# Altium project PS32-lite-rev_a_public.PrjPcb
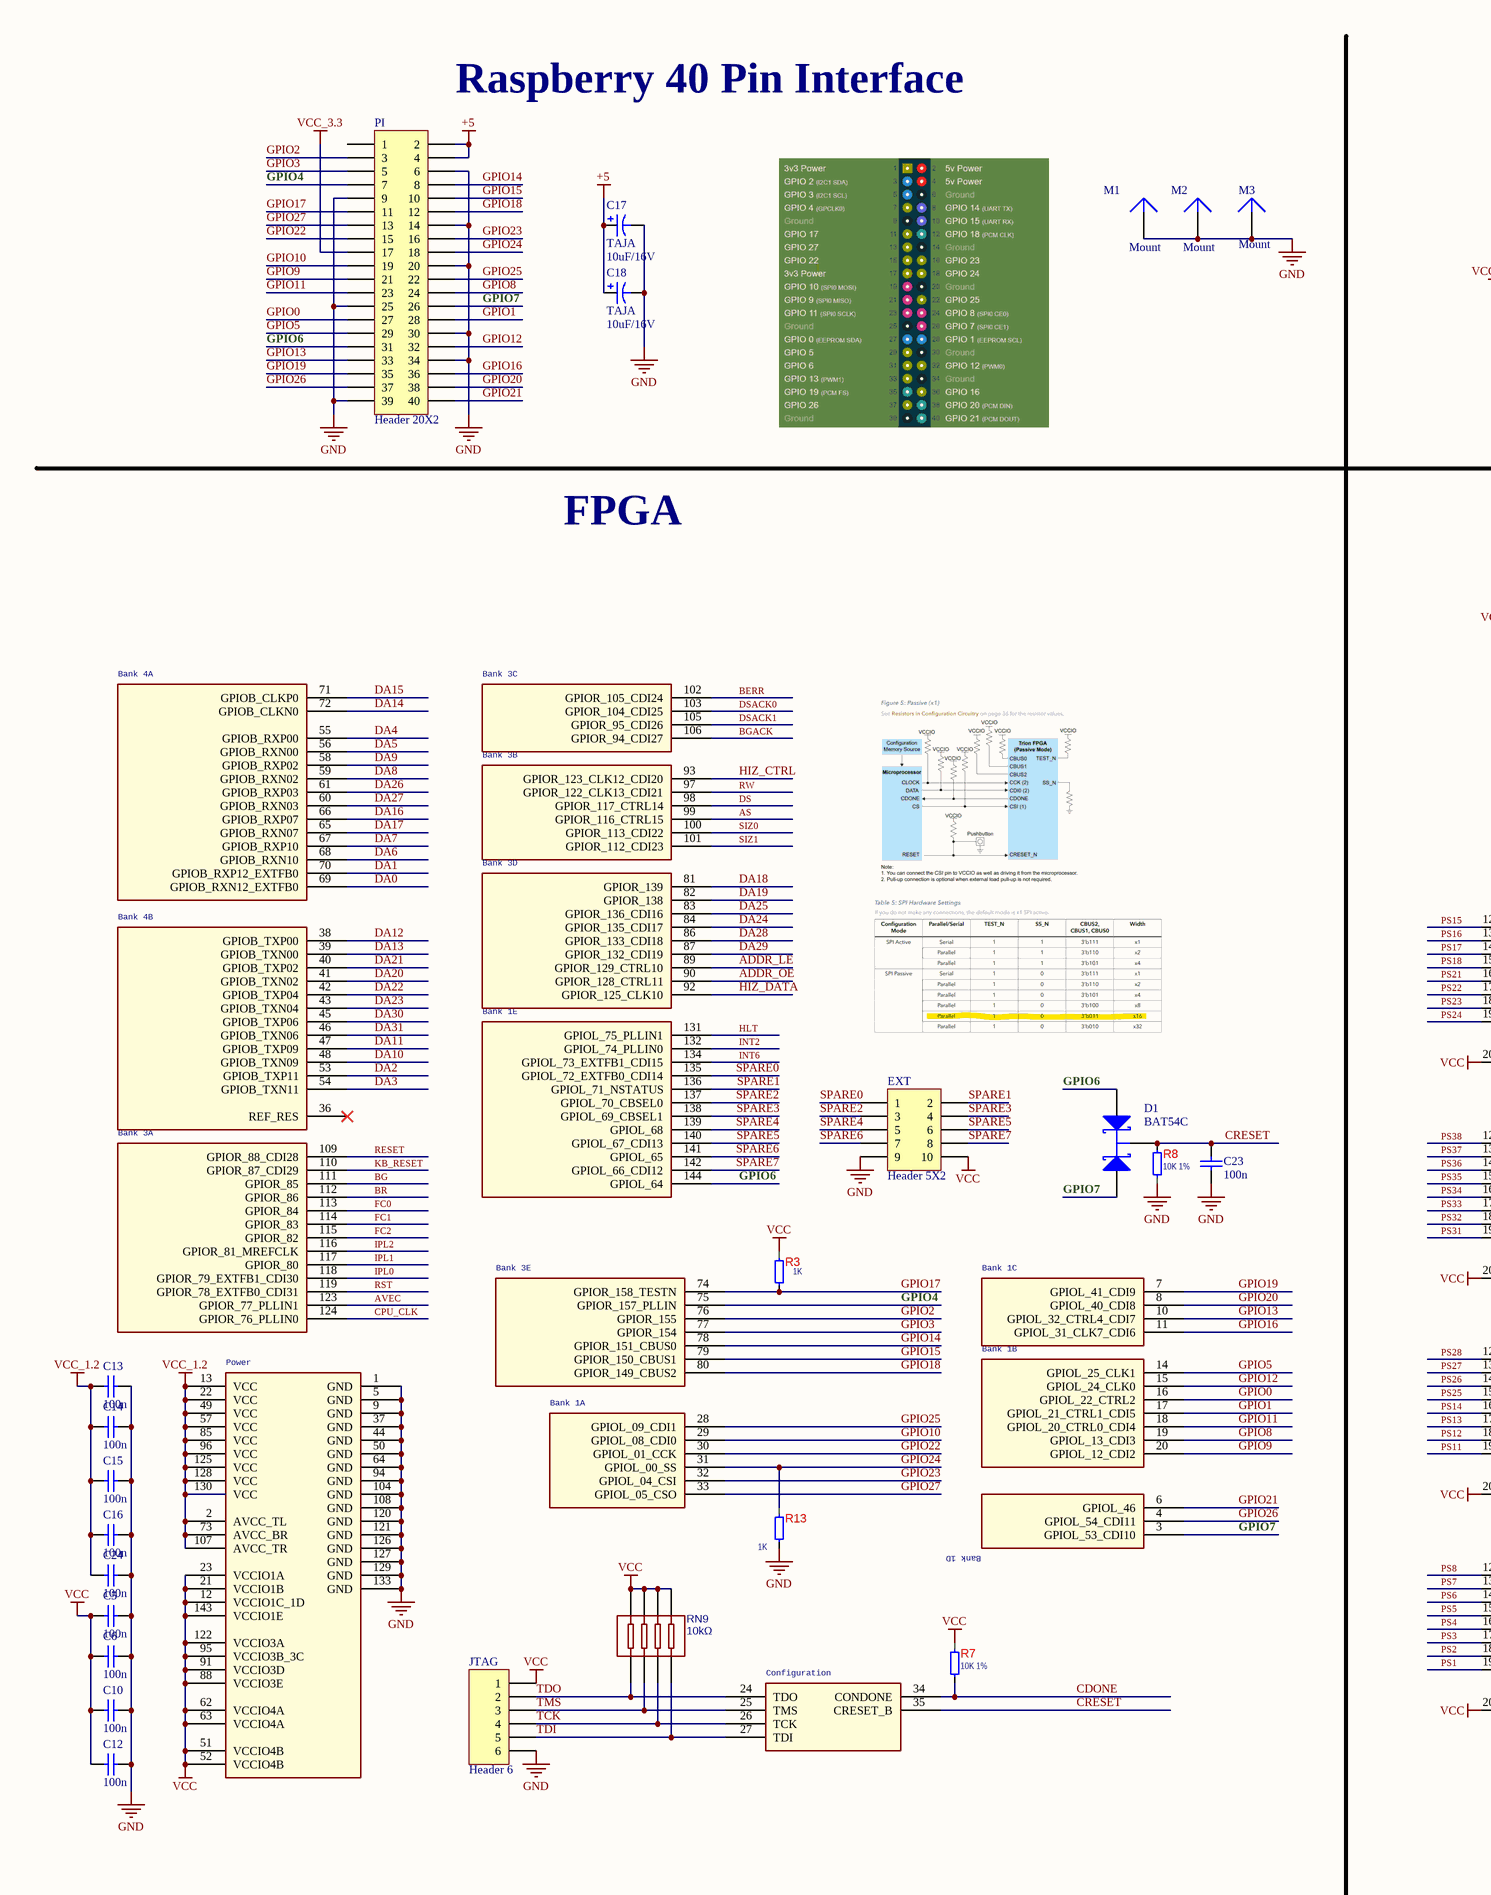
[diagram p0: PS32_lite_rev_a_public.SchDoc, left]
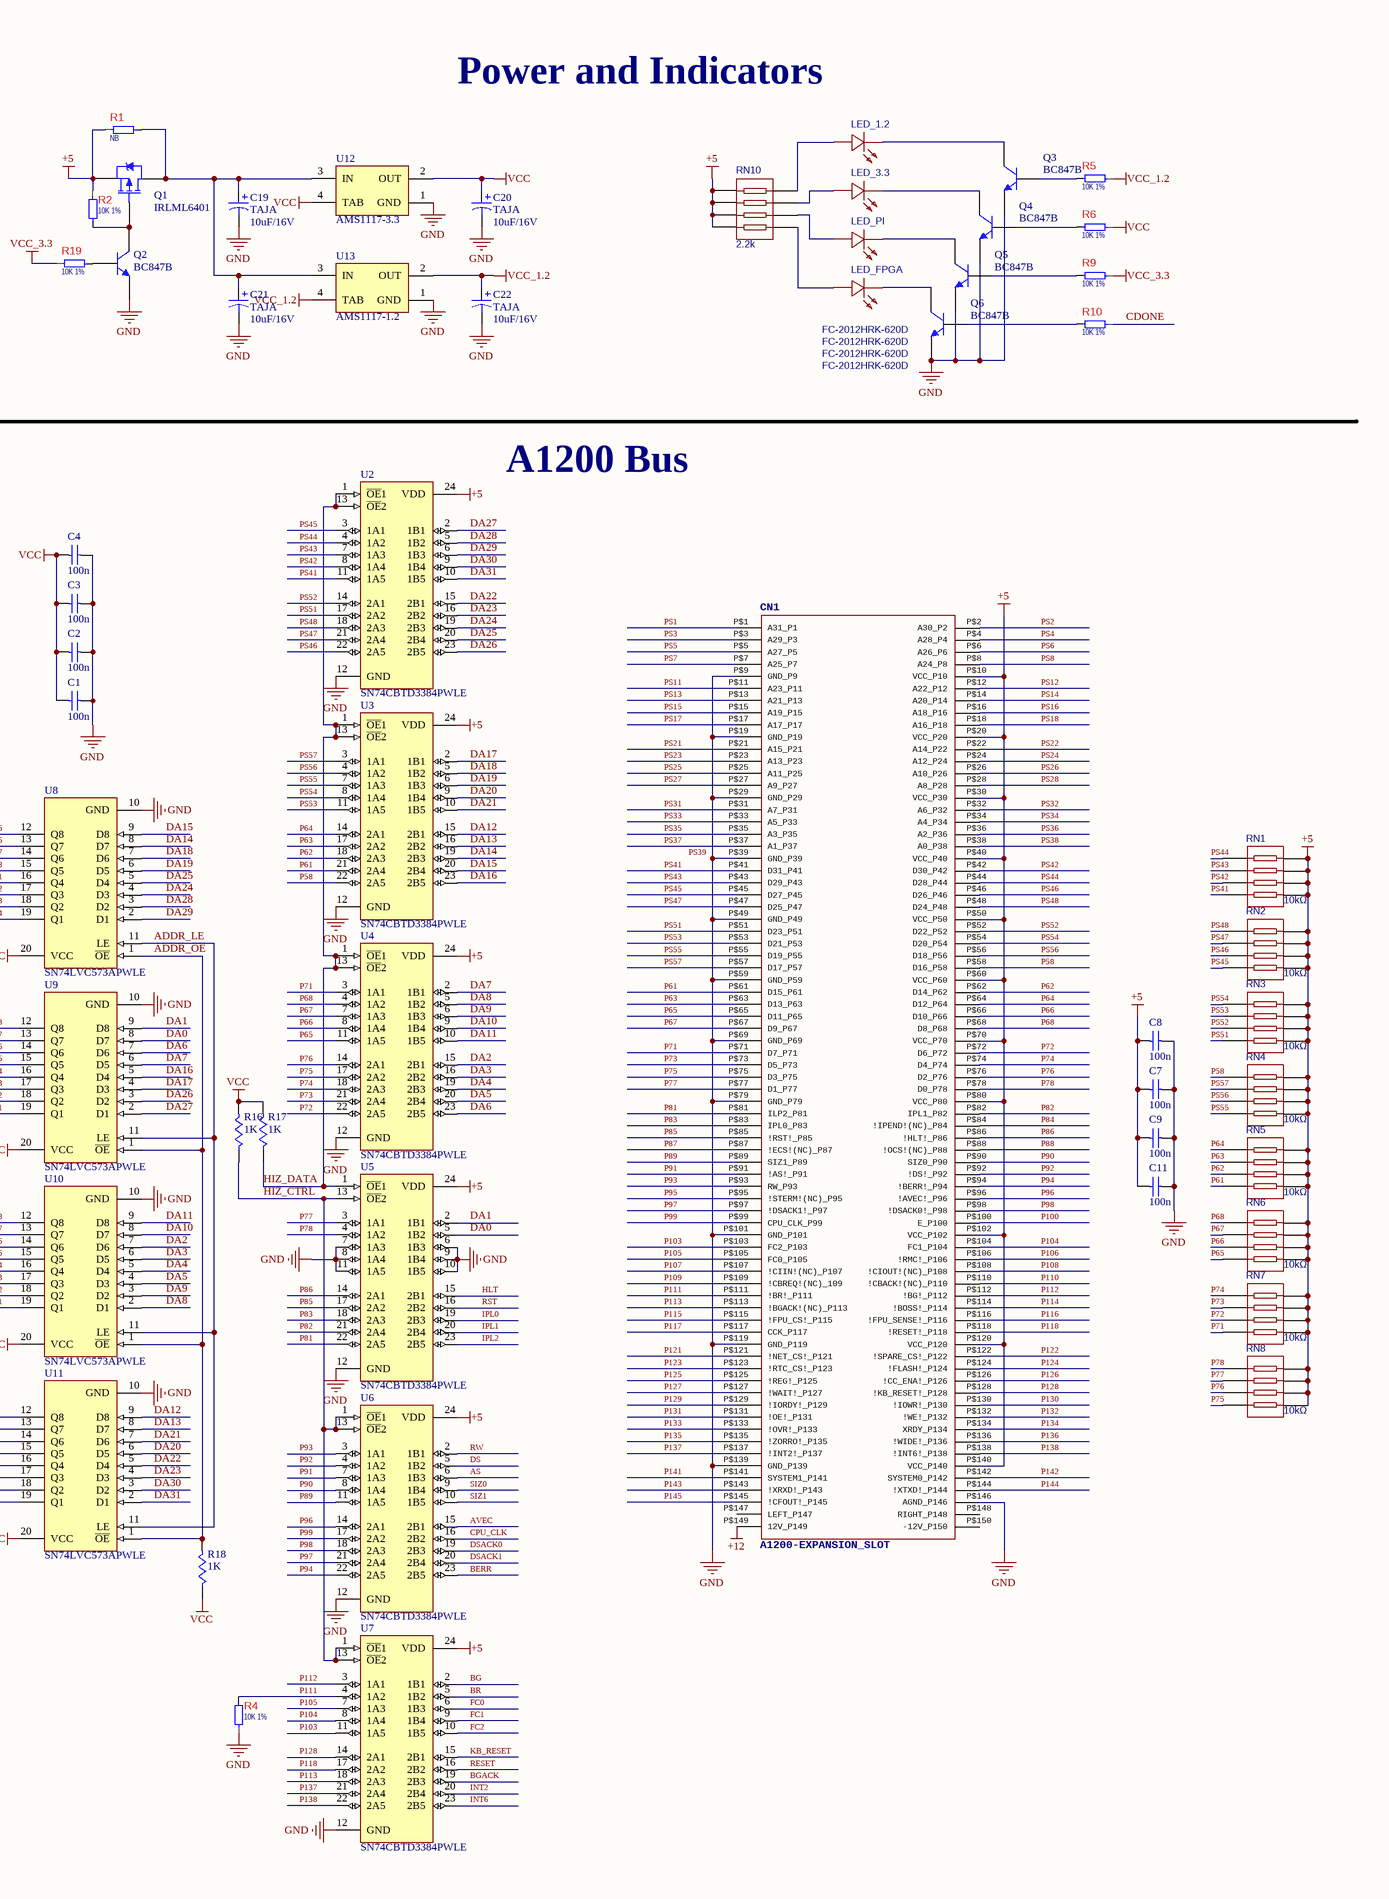
[diagram p1: PS32_lite_rev_a_public.SchDoc, right]
1 sheet, 80 parts. Net scope: global (net labels, ports and power ports of the same name join across sheets).
Board file: ps32-lite_rev_a_public.pcbdoc

## Sheet PS32_lite_rev_a_public.SchDoc
size A2; SheetNumber: 1; SheetTotal: 1; SPICEModelCacheICAJJOQO: <root> / <DocumentId>ICAJJOQO</DocumentId> / <CacheFrame Number="0"> / <Model Name="cap" Kind="MDL"> / <Text>*Default semiconductor capacitor / .MODEL CAP C()</Text> / </Model> / <Model Name="irlml6401" Kind="CKT"> / <Text>************************************** / *      Model Generated by MODPEX     * / *Copyright(c) Symmetry Design Systems* / *         All Rights Reserved        * / *    UNPUBLISHED LICENSED SOFTWARE   * / *   Contains Proprietary Information * / *      Which is The Property of      * / *     SYMMETRY OR ITS LICENSORS      * / *Commercial Use or Resale Restricted * / *   by Symmetry License Agreement    * / ************************************** / * Model generated on Mar 15, 02 / * MODEL FORMAT: SPICE3 / * Symmetry POWER MOS Model (Version 1.0) / * External Node Designations / * Node 1 -&gt; Drain / * Node 2 -&gt; Gate / * Node 3 -&gt; Source / .SUBCKT irlml6401 1 2 3 / M1 9 7 8 8 MM L=100u W=100u / .MODEL MM PMOS (LEVEL=1 IS=1e-32 / +VTO=-1 LAMBDA=0.263457 KP=29.6411 / +CGSO=6.28652e-06 CGDO=3.1e-07) / RS 8 3 0.0272644 / D1 1 3 MD / .MODEL MD D (IS=8.06174e-08 RS=0.0356243 N=1.5 BV=12 / +IBV=0.00025 EG=1 XTI=1 TT=0 / +CJO=1.19641e-10 VJ=5 M=0.898693 FC=0.5) / RDS 3 1 1e+06 / RD 9 1 0.0001 / RG 2 7 6 / D2 5 4 MD1 / * Default values used in MD1: / *   RS=0 EG=1.11 XTI=3.0 TT=0 / *   BV=infinite IBV=1mA / .MODEL MD1 D (IS=1e-32 N=50 / +CJO=2.19221e-10 VJ=8.26497 M=0.899999 FC=1e-08) / D3 5 0 MD2 / * Default values used in MD2: / *   EG=1.11 XTI=3.0 TT=0 CJO=0 / *   BV=infinite IBV=1mA / .MODEL MD2 D (IS=1e-10 N=0.4 RS=3e-06) / RL 5 10 1 / FI2 7 9 VFI2 -1 / VFI2 4 0 0 / EV16 10 0 9 7 1 / CAP 11 10 1.20397e-09 / FI1 7 9 VFI1 -1 / VFI1 11 6 0 / RCAP 6 10 1 / D4 6 0 MD3 / * Default values used in MD3: / *   EG=1.11 XTI=3.0 TT=0 CJO=0 / *   RS=0 BV=infinite IBV=1mA / .MODEL MD3 D (IS=1e-10 N=0.4) / .ENDS irlml6401</Text> / </Model> / <Model Name="qbc847b" Kind="MDL"> / <Text>* / .MODEL QBC847B NPN( / +     IS = 1.822E-14 / +     NF = 0.9932 / +     ISE = 2.894E-16 / +     NE = 1.4 / +     BF = 324.4 / +     IKF = 0.109 / +     VAF = 82 / +     NR = 0.9931 / +     ISC = 9.982E-12 / +     NC = 1.763 / +     BR = 8.29 / +     IKR = 0.09 / +     VAR = 17.9 / +     RB = 10 / +     IRB = 5E-06 / +     RBM = 5 / +     RE = 0.649 / +     RC = 0.7014 / +     XTB = 0 / +     EG = 1.11 / +     XTI = 3 / +     CJE = 1.244E-11 / +     VJE = 0.7579 / +     MJE = 0.3656 / +     TF = 4.908E-10 / +     XTF = 9.51 / +     VTF = 2.927 / +     ITF = 0.3131 / +     PTF = 0 / +     CJC = 3.347E-12 / +     VJC = 0.5463 / +     MJC = 0.391 / +     XCJC = 0.6193 / +     TR = 9E-08 / +     CJS = 0 / +     VJS = 0.75 / +     MJS = 0.333 / +     FC = 0.979)</Text> / </Model> / <Model Name="bat54c" Kind="CKT"> / <Text>* / .SUBCKT BAT54C 1 2 3 / * The resistors do not reflect / * physical devices.  Instead they / * improve modeling in the reverse / * mode of operation. / * / R1 1 3 3.6E+07 / D1 1 3 BAT54C / R2 2 3 3.6E+07 / D2 2 3 BAT54C / * / .MODEL BAT54C D / +( / +    IS = 2.117E-07 / +    N = 1.016 / +    BV = 36 / +    IBV = 1.196E-06 / +    RS = 2.637 / +    CJO = 1.114E-11 / +    VJ = 0.2013 / +    M = 0.3868 / +    FC = 0 / +    TT = 0 / +    EG = 0.69 / +    XTI = 2 / +) / .ENDS</Text> / </Model> / </CacheFrame> / </root>

### Parts
C1  value 100n  [1608[0603]]  (hidden comment: Cap Semi)
C2  value 100n  [1608[0603]]  (hidden comment: Cap Semi)
C3  value 100n  [1608[0603]]  (hidden comment: Cap Semi)
C4  value 100n  [1608[0603]]  (hidden comment: Cap Semi)
C5  value 100n  [1608[0603]]  (hidden comment: Cap Semi)
C6  value 100n  [1608[0603]]  (hidden comment: Cap Semi)
C7  value 100n  [1608[0603]]  (hidden comment: Cap Semi)
C8  value 100n  [1608[0603]]  (hidden comment: Cap Semi)
C9  value 100n  [1608[0603]]  (hidden comment: Cap Semi)
C10  value 100n  [1608[0603]]  (hidden comment: Cap Semi)
C11  value 100n  [1608[0603]]  (hidden comment: Cap Semi)
C12  value 100n  [1608[0603]]  (hidden comment: Cap Semi)
C13  value 100n  [1608[0603]]  (hidden comment: Cap Semi)
C14  value 100n  [1608[0603]]  (hidden comment: Cap Semi)
C15  value 100n  [1608[0603]]  (hidden comment: Cap Semi)
C16  value 100n  [1608[0603]]  (hidden comment: Cap Semi)
C17  TAJA  value 10uF/16V  [T]
C18  TAJA  value 10uF/16V  [T]
C19  TAJA  value 10uF/16V  [T]
C20  TAJA  value 10uF/16V  [T]
C21  TAJA  value 10uF/16V  [T]
C22  TAJA  value 10uF/16V  [T]
C23  value 100n  [1608[0603]]  (hidden comment: Cap Semi)
C24  value 100n  [1608[0603]]  (hidden comment: Cap Semi)
CN1  A1200-EXPANSION_SLOT  [CON_150]
D1  BAT54C  [SOT23_N]
EXT  Header 5X2  [HDR2X5]
JTAG  Header 6  [HDR1X6]
LED_1.2  FC-2012HRK-620D  [LED0805-RD]
LED_3.3  FC-2012HRK-620D  [LED0805-RD]
LED_FPGA  FC-2012HRK-620D  [LED0805-RD]
LED_PI  FC-2012HRK-620D  [LED0805-RD]
M1  Mount  [9774045151]
M2  Mount  [9774045151]
M3  Mount  [9774045151]
PI  Header 20X2  [CONN-SMD_FH-00369]
Q1  IRLML6401  [Micro3_N]
Q2  BC847B  [SOT23_N]
Q3  BC847B  [SOT23_N]
Q4  BC847B  [SOT23_N]
Q5  BC847B  [SOT23_N]
Q6  BC847B  [SOT23_N]
R1  Bauteiltyp (Altium): NB  [1608[0603]]  (hidden comment: E0424-846-00)
R2  Bauteiltyp (Altium): 10K 1%  [1608[0603]]  (hidden comment: E0424-846-00)
R3  Bauteiltyp (Altium): 1K  [1608[0603]]  (hidden comment: E0424-846-00)
R4  Bauteiltyp (Altium): 10K 1%  [1608[0603]]  (hidden comment: E0424-846-00)
R5  Bauteiltyp (Altium): 10K 1%  [1608[0603]]  (hidden comment: E0424-846-00)
R6  Bauteiltyp (Altium): 10K 1%  [1608[0603]]  (hidden comment: E0424-846-00)
R7  Bauteiltyp (Altium): 10K 1%  [1608[0603]]  (hidden comment: E0424-846-00)
R8  Bauteiltyp (Altium): 10K 1%  [1608[0603]]  (hidden comment: E0424-846-00)
R9  Bauteiltyp (Altium): 10K 1%  [1608[0603]]  (hidden comment: E0424-846-00)
R10  Bauteiltyp (Altium): 10K 1%  [1608[0603]]  (hidden comment: E0424-846-00)
R13  Bauteiltyp (Altium): 1K  [1608[0603]]  (hidden comment: E0424-846-00)
R16  1K  [1608[0603]]
R17  1K  [1608[0603]]
R18  1K  [1608[0603]]
R19  Bauteiltyp (Altium): 10K 1%  [1608[0603]]  (hidden comment: E0424-846-00)
RN1  10kΩ  [RES-ARRAY-SMD_0603-8P-L3.2-W1.6-BL]
RN2  10kΩ  [RES-ARRAY-SMD_0603-8P-L3.2-W1.6-BL]
RN3  10kΩ  [RES-ARRAY-SMD_0603-8P-L3.2-W1.6-BL]
RN4  10kΩ  [RES-ARRAY-SMD_0603-8P-L3.2-W1.6-BL]
RN5  10kΩ  [RES-ARRAY-SMD_0603-8P-L3.2-W1.6-BL]
RN6  10kΩ  [RES-ARRAY-SMD_0603-8P-L3.2-W1.6-BL]
RN7  10kΩ  [RES-ARRAY-SMD_0603-8P-L3.2-W1.6-BL]
RN8  10kΩ  [RES-ARRAY-SMD_0603-8P-L3.2-W1.6-BL]
RN9  10kΩ  [RES-ARRAY-SMD_0603-8P-L3.2-W1.6-BL]
RN10  2.2k  [RES-ARRAY-SMD_0603-8P-L3.2-W1.6-BL]
U1  T8Q144Cx  [LQFP144]  (value not drawn)  (parts A,B,C,D,E,F,G,H,I,J,K,L,M,N of 14)
U2  SN74CBTD3384PWLE  [PW024_N]
U3  SN74CBTD3384PWLE  [PW024_N]
U4  SN74CBTD3384PWLE  [PW024_N]
U5  SN74CBTD3384PWLE  [PW024_N]
U6  SN74CBTD3384PWLE  [PW024_N]
U7  SN74CBTD3384PWLE  [PW024_N]
U8  SN74LVC573APWLE  [PW020]
U9  SN74LVC573APWLE  [PW020]
U10  SN74LVC573APWLE  [PW020]
U11  SN74LVC573APWLE  [PW020]
U12  AMS1117-3.3  [MP04A_N]
U13  AMS1117-1.2  [MP04A_N]

### Nets
+5: C7.2 C8.2 C9.2 C11.2 C17.1 C18.1 CN1.P$10(VCC_P10) CN1.P$20(VCC_P20) CN1.P$30(VCC_P30) CN1.P$40(VCC_P40) CN1.P$50(VCC_P50) CN1.P$60(VCC_P60) CN1.P$70(VCC_P70) CN1.P$80(VCC_P80) CN1.P$102(VCC_P102) CN1.P$120(VCC_P120) CN1.P$140(VCC_P140) PI.2 PI.4 Q1.2(S) R1.2 R2.2 RN1.1 RN1.2 RN1.3 RN1.4 RN2.1 RN2.2 RN2.3 RN2.4 RN3.1 RN3.2 RN3.3 RN3.4 RN4.1 RN4.2 RN4.3 RN4.4 RN5.1 RN5.2 RN5.3 RN5.4 RN6.1 RN6.2 RN6.3 RN6.4 RN7.1 RN7.2 RN7.3 RN7.4 RN8.1 RN8.2 RN8.3 RN8.4 RN10.1 RN10.2 RN10.3 RN10.4 U2.24(VDD) U3.24(VDD) U4.24(VDD) U5.24(VDD) U6.24(VDD) U7.24(VDD)
+12: CN1.P$149(12V_P149)
GND: C1.1 C2.1 C3.1 C4.1 C5.1 C6.1 C7.1 C8.1 C9.1 C10.1 C11.1 C12.1 C13.1 C14.1 C15.1 C16.1 C17.2 C18.2 C19.2 C20.2 C21.2 C22.2 C23.2 C24.1 CN1.P$9(GND_P9) CN1.P$19(GND_P19) CN1.P$29(GND_P29) CN1.P$39(GND_P39) CN1.P$49(GND_P49) CN1.P$59(GND_P59) CN1.P$69(GND_P69) CN1.P$79(GND_P79) CN1.P$101(GND_P101) CN1.P$119(GND_P119) CN1.P$139(GND_P139) CN1.P$146(AGND_P146) EXT.9 JTAG.6 M1.1 M2.1 M3.1 PI.6 PI.9 PI.14 PI.20 PI.25 PI.30 PI.34 PI.39 Q2.2(E) Q3.2(E) Q4.2(E) Q5.2(E) Q6.2(E) R4.2 R8.2 R13.1 U1.1(GND) U1.5(GND) U1.9(GND) U1.37(GND) U1.44(GND) U1.50(GND) U1.64(GND) U1.94(GND) U1.104(GND) U1.108(GND) U1.120(GND) U1.121(GND) U1.126(GND) U1.127(GND) U1.129(GND) U1.133(GND) U2.12(GND) U3.12(GND) U4.12(GND) U5.6(1B3) U5.7(1A3) U5.8(1A4) U5.9(1B4) U5.10(1B5) U5.11(1A5) U5.12(GND) U6.12(GND) U7.12(GND) U8.10(GND) U9.10(GND) U10.10(GND) U11.10(GND) U12.1(GND) U13.1(GND)
VCC: C1.2 C2.2 C3.2 C4.2 C5.2 C6.2 C10.2 C12.2 C20.1 EXT.10 JTAG.1 R3.2 R6.2 R7.2 R16.1 R17.1 R18.2 RN9.1 RN9.2 RN9.3 RN9.4 U1.12(VCCIO1C_1D) U1.21(VCCIO1B) U1.23(VCCIO1A) U1.51(VCCIO4B) U1.52(VCCIO4B) U1.62(VCCIO4A) U1.63(VCCIO4A) U1.88(VCCIO3E) U1.91(VCCIO3D) U1.95(VCCIO3B_3C) U1.122(VCCIO3A) U1.143(VCCIO1E) U8.20(VCC) U9.20(VCC) U10.20(VCC) U11.20(VCC) U12.2(OUT) U12.4(TAB)
VCC_1.2: C13.2 C14.2 C15.2 C16.2 C22.1 C24.2 R5.2 U1.2(AVCC_TL) U1.13(VCC) U1.22(VCC) U1.49(VCC) U1.57(VCC) U1.73(AVCC_BR) U1.85(VCC) U1.96(VCC) U1.107(AVCC_TR) U1.125(VCC) U1.128(VCC) U1.130(VCC) U13.2(OUT) U13.4(TAB)
VCC_3.3: PI.17 R9.2 R19.2
ADDR_LE: U1.89(GPIOR_129_CTRL10) U8.11(LE) U9.11(LE) U10.11(LE) U11.11(LE)
ADDR_OE: R18.1 U1.90(GPIOR_128_CTRL11) U8.1(~{OE}) U9.1(~{OE}) U10.1(~{OE}) U11.1(~{OE})
AS: U1.99(GPIOR_116_CTRL15) U6.6(1B3)
AVEC: U1.123(GPIOR_77_PLLIN1) U6.15(2B1)
BERR: U1.102(GPIOR_105_CDI24) U6.23(2B5)
BG: U1.111(GPIOR_85) U7.2(1B1)
BGACK: U1.106(GPIOR_94_CDI27) U7.19(2B3)
BR: U1.112(GPIOR_86) U7.5(1B2)
CDONE: R7.1 R10.2 U1.34(CONDONE)
CPU_CLK: U1.124(GPIOR_76_PLLIN0) U6.16(2B2)
CRESET: C23.1 D1.3(K) R8.1 U1.35(CRESET_B)
DA0: U1.69(GPIOB_RXN12_EXTFB0) U5.5(1B2) U9.8(D7)
DA1: U1.70(GPIOB_RXP12_EXTFB0) U5.2(1B1) U9.9(D8)
DA2: U1.53(GPIOB_TXP11) U4.15(2B1) U10.7(D6)
DA3: U1.54(GPIOB_TXN11) U4.16(2B2) U10.6(D5)
DA4: U1.55(GPIOB_RXP00) U4.19(2B3) U10.5(D4)
DA5: U1.56(GPIOB_RXN00) U4.20(2B4) U10.4(D3)
DA6: U1.68(GPIOB_RXN10) U4.23(2B5) U9.7(D6)
DA7: U1.67(GPIOB_RXP10) U4.2(1B1) U9.6(D5)
DA8: U1.59(GPIOB_RXN02) U4.5(1B2) U10.2(D1)
DA9: U1.58(GPIOB_RXP02) U4.6(1B3) U10.3(D2)
DA10: U1.48(GPIOB_TXN09) U4.9(1B4) U10.8(D7)
DA11: U1.47(GPIOB_TXP09) U4.10(1B5) U10.9(D8)
DA12: U1.38(GPIOB_TXP00) U3.15(2B1) U11.9(D8)
DA13: U1.39(GPIOB_TXN00) U3.16(2B2) U11.8(D7)
DA14: U1.72(GPIOB_CLKN0) U3.19(2B3) U8.8(D7)
DA15: U1.71(GPIOB_CLKP0) U3.20(2B4) U8.9(D8)
DA16: U1.66(GPIOB_RXP07) U3.23(2B5) U9.5(D4)
DA17: U1.65(GPIOB_RXN07) U3.2(1B1) U9.4(D3)
DA18: U1.81(GPIOR_139) U3.5(1B2) U8.7(D6)
DA19: U1.82(GPIOR_138) U3.6(1B3) U8.6(D5)
DA20: U1.41(GPIOB_TXN02) U3.9(1B4) U11.6(D5)
DA21: U1.40(GPIOB_TXP02) U3.10(1B5) U11.7(D6)
DA22: U1.42(GPIOB_TXP04) U2.15(2B1) U11.5(D4)
DA23: U1.43(GPIOB_TXN04) U2.16(2B2) U11.4(D3)
DA24: U1.84(GPIOR_135_CDI17) U2.19(2B3) U8.4(D3)
DA25: U1.83(GPIOR_136_CDI16) U2.20(2B4) U8.5(D4)
DA26: U1.61(GPIOB_RXP03) U2.23(2B5) U9.3(D2)
DA27: U1.60(GPIOB_RXN03) U2.2(1B1) U9.2(D1)
DA28: U1.86(GPIOR_133_CDI18) U2.5(1B2) U8.3(D2)
DA29: U1.87(GPIOR_132_CDI19) U2.6(1B3) U8.2(D1)
DA30: U1.45(GPIOB_TXP06) U2.9(1B4) U11.3(D2)
DA31: U1.46(GPIOB_TXN06) U2.10(1B5) U11.2(D1)
DS: U1.98(GPIOR_117_CTRL14) U6.5(1B2)
DSACK0: U1.103(GPIOR_104_CDI25) U6.19(2B3)
DSACK1: U1.105(GPIOR_95_CDI26) U6.20(2B4)
FC0: U1.113(GPIOR_84) U7.6(1B3)
FC1: U1.114(GPIOR_83) U7.9(1B4)
FC2: U1.115(GPIOR_82) U7.10(1B5)
GPIO0: PI.27 U1.16(GPIOL_22_CTRL2)
GPIO1: PI.28 U1.17(GPIOL_21_CTRL1_CDI5)
GPIO2: PI.3 U1.76(GPIOR_155)
GPIO3: PI.5 U1.77(GPIOR_154)
GPIO4: PI.7 U1.75(GPIOR_157_PLLIN)
GPIO5: PI.29 U1.14(GPIOL_25_CLK1)
GPIO6: D1.1(A1) PI.31 U1.144(GPIOL_64)
GPIO7: D1.2(A2) PI.26 U1.3(GPIOL_53_CDI10)
GPIO8: PI.24 U1.19(GPIOL_13_CDI3)
GPIO9: PI.21 U1.20(GPIOL_12_CDI2)
GPIO10: PI.19 U1.29(GPIOL_08_CDI0)
GPIO11: PI.23 U1.18(GPIOL_20_CTRL0_CDI4)
GPIO12: PI.32 U1.15(GPIOL_24_CLK0)
GPIO13: PI.33 U1.10(GPIOL_32_CTRL4_CDI7)
GPIO14: PI.8 U1.78(GPIOR_151_CBUS0)
GPIO15: PI.10 U1.79(GPIOR_150_CBUS1)
GPIO16: PI.36 U1.11(GPIOL_31_CLK7_CDI6)
GPIO17: PI.11 R3.1 U1.74(GPIOR_158_TESTN)
GPIO18: PI.12 U1.80(GPIOR_149_CBUS2)
GPIO19: PI.35 U1.7(GPIOL_41_CDI9)
GPIO20: PI.38 U1.8(GPIOL_40_CDI8)
GPIO21: PI.40 U1.6(GPIOL_46)
GPIO22: PI.15 U1.30(GPIOL_01_CCK)
GPIO23: PI.16 U1.32(GPIOL_04_CSI)
GPIO24: PI.18 R13.2 U1.31(GPIOL_00_SS)
GPIO25: PI.22 U1.28(GPIOL_09_CDI1)
GPIO26: PI.37 U1.4(GPIOL_54_CDI11)
GPIO27: PI.13 U1.33(GPIOL_05_CSO)
HIZ_CTRL: R16.2 U1.93(GPIOR_123_CLK12_CDI20) U5.13(~{OE}2) U6.1(~{OE}1) U6.13(~{OE}2) U7.1(~{OE}1) U7.13(~{OE}2)
HIZ_DATA: R17.2 U1.92(GPIOR_125_CLK10) U2.1(~{OE}1) U2.13(~{OE}2) U3.1(~{OE}1) U3.13(~{OE}2) U4.1(~{OE}1) U4.13(~{OE}2) U5.1(~{OE}1)
HLT: U1.131(GPIOL_75_PLLIN1) U5.15(2B1)
INT2: U1.132(GPIOL_74_PLLIN0) U7.20(2B4)
INT6: U1.134(GPIOL_73_EXTFB1_CDI15) U7.23(2B5)
IPL0: U1.118(GPIOR_79_EXTFB1_CDI30) U5.19(2B3)
IPL1: U1.117(GPIOR_80) U5.20(2B4)
IPL2: U1.116(GPIOR_81_MREFCLK) U5.23(2B5)
KB_RESET: U1.110(GPIOR_87_CDI29) U7.15(2B1)
P58: CN1.P$58(D16_P58) RN4.8 U3.22(2A5)
P61: CN1.P$61(D15_P61) RN5.5 U3.21(2A4)
P62: CN1.P$62(D14_P62) RN5.6 U3.18(2A3)
P63: CN1.P$63(D13_P63) RN5.7 U3.17(2A2)
P64: CN1.P$64(D12_P64) RN5.8 U3.14(2A1)
P65: CN1.P$65(D11_P65) RN6.5 U4.11(1A5)
P66: CN1.P$66(D10_P66) RN6.6 U4.8(1A4)
P67: CN1.P$67(D9_P67) RN6.7 U4.7(1A3)
P68: CN1.P$68(D8_P68) RN6.8 U4.4(1A2)
P71: CN1.P$71(D7_P71) RN7.5 U4.3(1A1)
P72: CN1.P$72(D6_P72) RN7.6 U4.22(2A5)
P73: CN1.P$73(D5_P73) RN7.7 U4.21(2A4)
P74: CN1.P$74(D4_P74) RN7.8 U4.18(2A3)
P75: CN1.P$75(D3_P75) RN8.5 U4.17(2A2)
P76: CN1.P$76(D2_P76) RN8.6 U4.14(2A1)
P77: CN1.P$77(D1_P77) RN8.7 U5.3(1A1)
P78: CN1.P$78(D0_P78) RN8.8 U5.4(1A2)
P81: CN1.P$81(ILP2_P81) U5.22(2A5)
P82: CN1.P$82(IPL1_P82) U5.21(2A4)
P83: CN1.P$83(IPL0_P83) U5.18(2A3)
P84: CN1.P$84(!IPEND!(NC)_P84)
P85: CN1.P$85(!RST!_P85) U5.17(2A2)
P86: CN1.P$86(!HLT!_P86) U5.14(2A1)
P87: CN1.P$87(!ECS!(NC)_P87)
P88: CN1.P$88(!OCS!(NC)_P88)
P89: CN1.P$89(SIZ1_P89) U6.11(1A5)
P90: CN1.P$90(SIZ0_P90) U6.8(1A4)
P91: CN1.P$91(!AS!_P91) U6.7(1A3)
P92: CN1.P$92(!DS!_P92) U6.4(1A2)
P93: CN1.P$93(RW_P93) U6.3(1A1)
P94: CN1.P$94(!BERR!_P94) U6.22(2A5)
P95: CN1.P$95(!STERM!(NC)_P95)
P96: CN1.P$96(!AVEC!_P96) U6.14(2A1)
P97: CN1.P$97(!DSACK1!_P97) U6.21(2A4)
P98: CN1.P$98(!DSACK0!_P98) U6.18(2A3)
P99: CN1.P$99(CPU_CLK_P99) U6.17(2A2)
P100: CN1.P$100(E_P100)
P103: CN1.P$103(FC2_P103) U7.11(1A5)
P104: CN1.P$104(FC1_P104) U7.8(1A4)
P105: CN1.P$105(FC0_P105) U7.7(1A3)
P106: CN1.P$106(!RMC!_P106)
P107: CN1.P$107(!CIIN!(NC)_P107)
P108: CN1.P$108(!CIOUT!(NC)_P108)
P109: CN1.P$109(!CBREQ!(NC)_109)
P110: CN1.P$110(!CBACK!(NC)_P110)
P111: CN1.P$111(!BR!_P111) R4.1 U7.4(1A2)
P112: CN1.P$112(!BG!_P112) U7.3(1A1)
P113: CN1.P$113(!BGACK!(NC)_P113) U7.18(2A3)
P114: CN1.P$114(!BOSS!_P114)
P115: CN1.P$115(!FPU_CS!_P115)
P116: CN1.P$116(!FPU_SENSE!_P116)
P117: CN1.P$117(CCK_P117)
P118: CN1.P$118(!RESET!_P118) U7.17(2A2)
P121: CN1.P$121(!NET_CS!_P121)
P122: CN1.P$122(!SPARE_CS!_P122)
P123: CN1.P$123(!RTC_CS!_P123)
P124: CN1.P$124(!FLASH!_P124)
P125: CN1.P$125(!REG!_P125)
P126: CN1.P$126(!CC_ENA!_P126)
P127: CN1.P$127(!WAIT!_P127)
P128: CN1.P$128(!KB_RESET!_P128) U7.14(2A1)
P129: CN1.P$129(!IORDY!_P129)
P130: CN1.P$130(!IOWR!_P130)
P131: CN1.P$131(!OE!_P131)
P132: CN1.P$132(!WE!_P132)
P133: CN1.P$133(!OVR!_P133)
P134: CN1.P$134(XRDY_P134)
P135: CN1.P$135(!ZORRO!_P135)
P136: CN1.P$136(!WIDE!_P136)
P137: CN1.P$137(!INT2!_P137) U7.21(2A4)
P138: CN1.P$138(!INT6!_P138) U7.22(2A5)
P141: CN1.P$141(SYSTEM1_P141)
P142: CN1.P$142(SYSTEM0_P142)
P143: CN1.P$143(!XRXD!_P143)
P144: CN1.P$144(!XTXD!_P144)
P145: CN1.P$145(!CFOUT!_P145)
PS1: CN1.P$1(A31_P1) U11.19(Q1)
PS2: CN1.P$2(A30_P2) U11.18(Q2)
PS3: CN1.P$3(A29_P3) U11.17(Q3)
PS4: CN1.P$4(A28_P4) U11.16(Q4)
PS5: CN1.P$5(A27_P5) U11.15(Q5)
PS6: CN1.P$6(A26_P6) U11.14(Q6)
PS7: CN1.P$7(A25_P7) U11.13(Q7)
PS8: CN1.P$8(A24_P8) U11.12(Q8)
PS11: CN1.P$11(A23_P11) U10.19(Q1)
PS12: CN1.P$12(A22_P12) U10.18(Q2)
PS13: CN1.P$13(A21_P13) U10.17(Q3)
PS14: CN1.P$14(A20_P14) U10.16(Q4)
PS15: CN1.P$15(A19_P15) U8.12(Q8)
PS16: CN1.P$16(A18_P16) U8.13(Q7)
PS17: CN1.P$17(A17_P17) U8.14(Q6)
PS18: CN1.P$18(A16_P18) U8.15(Q5)
PS21: CN1.P$21(A15_P21) U8.16(Q4)
PS22: CN1.P$22(A14_P22) U8.17(Q3)
PS23: CN1.P$23(A13_P23) U8.18(Q2)
PS24: CN1.P$24(A12_P24) U8.19(Q1)
PS25: CN1.P$25(A11_P25) U10.15(Q5)
PS26: CN1.P$26(A10_P26) U10.14(Q6)
PS27: CN1.P$27(A9_P27) U10.13(Q7)
PS28: CN1.P$28(A8_P28) U10.12(Q8)
PS31: CN1.P$31(A7_P31) U9.19(Q1)
PS32: CN1.P$32(A6_P32) U9.18(Q2)
PS33: CN1.P$33(A5_P33) U9.17(Q3)
PS34: CN1.P$34(A4_P34) U9.16(Q4)
PS35: CN1.P$35(A3_P35) U9.15(Q5)
PS36: CN1.P$36(A2_P36) U9.14(Q6)
PS37: CN1.P$37(A1_P37) U9.13(Q7)
PS38: CN1.P$38(A0_P38) U9.12(Q8)
PS41: CN1.P$41(D31_P41) RN1.5 U2.11(1A5)
PS42: CN1.P$42(D30_P42) RN1.6 U2.8(1A4)
PS43: CN1.P$43(D29_P43) RN1.7 U2.7(1A3)
PS44: CN1.P$44(D28_P44) RN1.8 U2.4(1A2)
PS45: CN1.P$45(D27_P45) RN2.5 U2.3(1A1)
PS46: CN1.P$46(D26_P46) RN2.6 U2.22(2A5)
PS47: CN1.P$47(D25_P47) RN2.7 U2.21(2A4)
PS48: CN1.P$48(D24_P48) RN2.8 U2.18(2A3)
PS51: CN1.P$51(D23_P51) RN3.5 U2.17(2A2)
PS52: CN1.P$52(D22_P52) RN3.6 U2.14(2A1)
PS53: CN1.P$53(D21_P53) RN3.7 U3.11(1A5)
PS54: CN1.P$54(D20_P54) RN3.8 U3.8(1A4)
PS55: CN1.P$55(D19_P55) RN4.5 U3.7(1A3)
PS56: CN1.P$56(D18_P56) RN4.6 U3.4(1A2)
PS57: CN1.P$57(D17_P57) RN4.7 U3.3(1A1)
RESET: U1.109(GPIOR_88_CDI28) U7.16(2B2)
RST: U1.119(GPIOR_78_EXTFB0_CDI31) U5.16(2B2)
RW: U1.97(GPIOR_122_CLK13_CDI21) U6.2(1B1)
SIZ0: U1.100(GPIOR_113_CDI22) U6.9(1B4)
SIZ1: U1.101(GPIOR_112_CDI23) U6.10(1B5)
SPARE0: EXT.1 U1.135(GPIOL_72_EXTFB0_CDI14)
SPARE1: EXT.2 U1.136(GPIOL_71_NSTATUS)
SPARE2: EXT.3 U1.137(GPIOL_70_CBSEL0)
SPARE3: EXT.4 U1.138(GPIOL_69_CBSEL1)
SPARE4: EXT.5 U1.139(GPIOL_68)
SPARE5: EXT.6 U1.140(GPIOL_67_CDI13)
SPARE6: EXT.7 U1.141(GPIOL_65)
SPARE7: EXT.8 U1.142(GPIOL_66_CDI12)
TCK: JTAG.4 RN9.6 U1.26(TCK)
TDI: JTAG.5 RN9.5 U1.27(TDI)
TDO: JTAG.2 RN9.8 U1.24(TDO)
TMS: JTAG.3 RN9.7 U1.25(TMS)
NetC19_1: C19.1 C21.1 Q1.3(D) R1.1 U12.3(IN) U13.3(IN)
NetLED_1.2_1: LED_1.2.1(-) Q3.3(C)
NetLED_1.2_2: LED_1.2.2(+) RN10.5
NetLED_3.3_1: LED_3.3.1(-) Q4.3(C)
NetLED_3.3_2: LED_3.3.2(+) RN10.6
NetLED_FPGA_1: LED_FPGA.1(-) Q6.3(C)
NetLED_FPGA_2: LED_FPGA.2(+) RN10.8
NetLED_PI_1: LED_PI.1(-) Q5.3(C)
NetLED_PI_2: LED_PI.2(+) RN10.7
NetQ1_1: Q1.1(G) Q2.3(C) R2.1
NetQ2_1: Q2.1(B) R19.1
NetQ3_1: Q3.1(B) R5.1
NetQ4_1: Q4.1(B) R6.1
NetQ5_1: Q5.1(B) R9.1
NetQ6_1: Q6.1(B) R10.1

Not connected (* = marked no-connect by the designer): CN1 P$147(LEFT_P147) P$148(RIGHT_P148) P$150(-12V_P150); PI 1; U1 36(REF_RES)*

### Notes on the sheet
- (near PI) Raspberry 40 Pin Interface
- Power and Indicators
- FPGA
- A1200 Bus
- Labels drawn without touching a wire or pin: PS39
- (in symbol T8Q144Cx, part A) Power
- (in symbol T8Q144Cx, part B) Configuration
- (in symbol T8Q144Cx, part C) Bank 1A
- (in symbol T8Q144Cx, part D) Bank 1B
- (in symbol T8Q144Cx, part E) Bank 1C
- (in symbol T8Q144Cx, part F) Bank 1D
- (in symbol T8Q144Cx, part G) Bank 1E
- (in symbol T8Q144Cx, part H) Bank 3A
- (in symbol T8Q144Cx, part I) Bank 3B
- (in symbol T8Q144Cx, part J) Bank 3C
- (in symbol T8Q144Cx, part K) Bank 3D
- (in symbol T8Q144Cx, part L) Bank 3E
- (in symbol T8Q144Cx, part M) Bank 4A
- (in symbol T8Q144Cx, part N) Bank 4B

### Library data of the parts
C1-C16 C23 C24 = Cap Semi: Capacitor (Semiconductor SIM Model); Published: 8-Jun-2000; LatestRevisionDate: 29-May-2009; LatestRevisionNote: IPC-7351 Footprint Added.; PackageReference: C1206; Publisher: Altium Limited; PackageDescription: Chip Capacitor
C17-C22 = T491T: Solid Tantalum Chip Capacitor, Low Profile T491 Series - Industrial Grade; Published: 17-Jul-2002; LatestRevisionDate: 19-Mar-2004; LatestRevisionNote: Silkscreen dimensions re-sized.; DatasheetDocument: Mar-2001; PackageDocument: Mar-2001; PackageReference: T; Publisher: Altium Limited; Code_JEITA: 3528-12; ComponentLink1Description: Manufacturer Link; ComponentLink1URL: http://www.kemet.com/; ComponentLink2Description: Datasheet; ComponentLink2URL: http://www.kemet.com/kemet/web/homepage/kechome.nsf/vapubfilesname/F3102TA.pdf/$file/F3102TA.pdf
CN1 = A1200-EXPANSION_SLOT-SMALL-HOLES
D1 = BAT54C: Schottky Barrier Double Diode; Published: 17-Sep-2003; LatestRevisionDate: 12-Dec-2006; LatestRevisionNote: IPC-7351 Footprint Added.; DatasheetVersion: 4-Mar-2002; PackageVersion: May-1999; PackageReference: SOT23; Publisher: Altium Limited; PackageDescription: 3-Pin SOT-23 Package 0.95 mm Pitch, 2.3 mm Lead Span; ComponentLink1Description: Manufacturer Link; ComponentLink1URL: http://www.semiconductors.philips.com/; ComponentLink2Description: Datasheet; ComponentLink2URL: http://www.semiconductors.philips.com/acrobat/datasheets/BAT54_SERIES_4.pdf
EXT = Header 5X2: Header, 5-Pin, Dual row; LatestRevisionDate: 17-Jul-2002; LatestRevisionNote: Re-released for DXP Platform.; Publisher: Altium Limited
JTAG = Header 6: Header, 6-Pin; LatestRevisionDate: 17-Jul-2002; LatestRevisionNote: Re-released for DXP Platform.; Publisher: Altium Limited
LED_1.2 LED_3.3 LED_FPGA LED_PI = FC-2012HRK-620D: BOM_Manufacturer: NATIONSTAR; BOM_Supplier: LCSC; BOM_Manufacturer Part: FC-2012HRK-620D; BOM_Supplier Part: C84256; BOM_JLCPCB Part Class: Basic Part; spicePre: L; spiceSymbolName: FC-2012HRK-620D
M1-M3 = Plug: LatestRevisionDate: 17-Jul-2002; LatestRevisionNote: Re-released for DXP Platform.; Publisher: Altium Limited
PI = Header 20X2: Header, 20-Pin, Dual row; LatestRevisionDate: 17-Jul-2002; LatestRevisionNote: Re-released for DXP Platform.; Publisher: Altium Limited
Q1 = IRLML6401: HEXFET Power MOSFET; Published: 17-Sep-2003; DatasheetVersion: 2-Jul-2001; PackageVersion: Jul-2001; PackageReference: Micro3; Publisher: Altium Limited; PackageDescription: 3-Pin SOT-23 Package 0.95 mm Pitch, 2.3 mm Lead Span; ComponentLink1Description: Manufacturer Link; ComponentLink1URL: http://www.irf.com/; ComponentLink2Description: Datasheet; ComponentLink2URL: http://www.irf.com/product-info/datasheets/data/IRLML6401.pdf
Q2-Q6 = BC847B: NPN General-purpose Transistor; Published: 17-Sep-2003; LatestRevisionDate: 12-Dec-2006; LatestRevisionNote: IPC-7351 Footprint Added.; DatasheetVersion: 4-Feb-2002; PackageVersion: May-1999; PackageReference: SOT23; Publisher: Altium Limited; PackageDescription: 3-Pin SOT-23 Package 0.95 mm Pitch, 2.3 mm Lead Span; ComponentLink1Description: Manufacturer Link; ComponentLink1URL: http://www.semiconductors.philips.com/; ComponentLink2Description: Datasheet; ComponentLink2URL: http://www.semiconductors.philips.com/acrobat/datasheets/BC846_BC847_BC848_5.pdf
R1-R10 R13 R19 = E0424-846-00: Widerstand; Bauform: 0402; AEC-Q: 200 - Passive Components; Verpackungsart: TR (Tape & Reel); Verpackungseinheit: 10.000; Montagetechnik: SMT (Surface Mount Technology); min  Betriebstemperatur: -55 °C; max  Betriebstemperatur: 155 °C; Materialstatus: 30; Materialkurztext: WID-ME-SMD 10K 0402 1% TK100; Materialart: KAUF; Nennleistung P(n): 0,0625 W; Nennspannung U(n): 50,00 V; Nennwiderstand R(n) in Ohm: 10.000,0000 Ohm; Toleranz: 1,00 %; Technologie: Metalloxid; Temperaturkoeffizient: 100 PPM/K; HelpURL: http://de.wikipedia.org/wiki/Widerstand_(Bauelement); ComponentLink1URL: z.B. http://www.; ComponentLink1Description: Datasheet; Artikel: E0424-846-00; ROHS-Konformitaet: RoHS-Konform
R16-R18 = 004-00008: RES 22 OHM 1/16W 5% 0402; Part Number: 009-00020; Manufacturer1 Part Number: RMCF0402JT22R0; Manufacturer1: Stackpole Electronics; Tolerance: 0.05; Value: 22; Power: 1/16W; Package: 1005, EIA 0402, Chip Resistor, 2-Leads, Body 1.00x0.50mm, IPC High Density
RN1-RN10 = 10kΩ: BOM_Manufacturer: UniOhm; BOM_Manufacturer Part: 4D03WGJ0103T5E; nameAlias: Resistance; Resistance (Ohms): 10K; BOM_Supplier: LCSC; BOM_Supplier Part: C29718; BOM_JLCPCB Part Class: Basic Part; spicePre: R; spiceSymbolName: 4D03WGJ0103T5E
U1 = T8Q144Cx: SPLIT_INST: TRUE; SWAP_INFO: (S1+S2+S3+S4+S5+S6+S7+S8+S9+S10+S11+S12+S13+S14)
U2-U7 = SN74CBTD3384PWLE: 10-Bit FET Bus Switch with Level Shifting; ComponentAvailability: Obsolete; Published: 8-Jun-2000; LatestRevisionDate: 16-Oct-2006; LatestRevisionNote: IPC-7351 Footprint Added.; DatasheetVersion: Nov-1998; PackageVersion: Feb-1999; PackageReference: PW024; Publisher: Altium Limited; PackageDescription: 24-Pin Thin Small Outline Package 0.65 mm Pitch; ComponentLink1Description: Manufacturer Link; ComponentLink1URL: http://www.ti.com/; ComponentLink2Description: Datasheet; ComponentLink2URL: http://www-s.ti.com/sc/ds/sn74cbtd3384.pdf
U8-U11 = SN74LVC573APWLE: Octal Transparent D-Type Latch with 3-State Outputs; ComponentAvailability: Obsolete; Published: 8-Jun-2000; LatestRevisionDate: 04-Mar-2005; LatestRevisionNote: Stylized 3D Model Added.; DatasheetVersion: Jun-1998; PackageVersion: Feb-1999; PackageReference: PW020; Publisher: Altium Limited; PackageDescription: Shrink Small Outline; 20 Leads; Body Width 4.4 mm; Pitch 0.65 mm; ComponentLink1Description: Manufacturer Link; ComponentLink1URL: http://www.ti.com/; ComponentLink2Description: Datasheet; ComponentLink2URL: http://www-s.ti.com/sc/ds/sn74lvc573a.pdf
U12 U13 = LM1117IMPX-3.3: 800mA Low-Dropout Linear Regulator, 4-pin SOT-223; Manufacturer: National Semiconductor; PackageTopMarking: XYTT*N05B; PowerWise: N; CompType: LDO IC; Published: 1-Mar-2010; DatasheetVersion: Apr-2006; PackageVersion: revB, Apr-2003; PackageReference: MP04A; Publisher: Altium Limited; PackageDescription: Molded SOT-223, 6.50 x 3.56 x 1.6mm Body, 4 Lead, 2.3mm Pitch; PartNumber: LM1117IMPX-3.3; RoHS: N; PinCount: 4; Code_JEDEC: TO-261-AA; Code_IPC: SOT223-4; ComponentLink1Description: LM1117 Datasheet; ComponentLink1URL: http://www.national.com/ds/LM/LM1117.pdf; ComponentLink2Description: LM1117 Web Page; ComponentLink2URL: http://www.national.com/pf/LM/LM1117.html; ComponentLink3Description: MP04A Package Page; ComponentLink3URL: http://www.national.com/packaging/folders/mp04a.html

## Assembly variants
With Power Sequencing: not fitted JTAG R1